# EAGLE schematic MultiDrop (EAGLE 7.6.0)
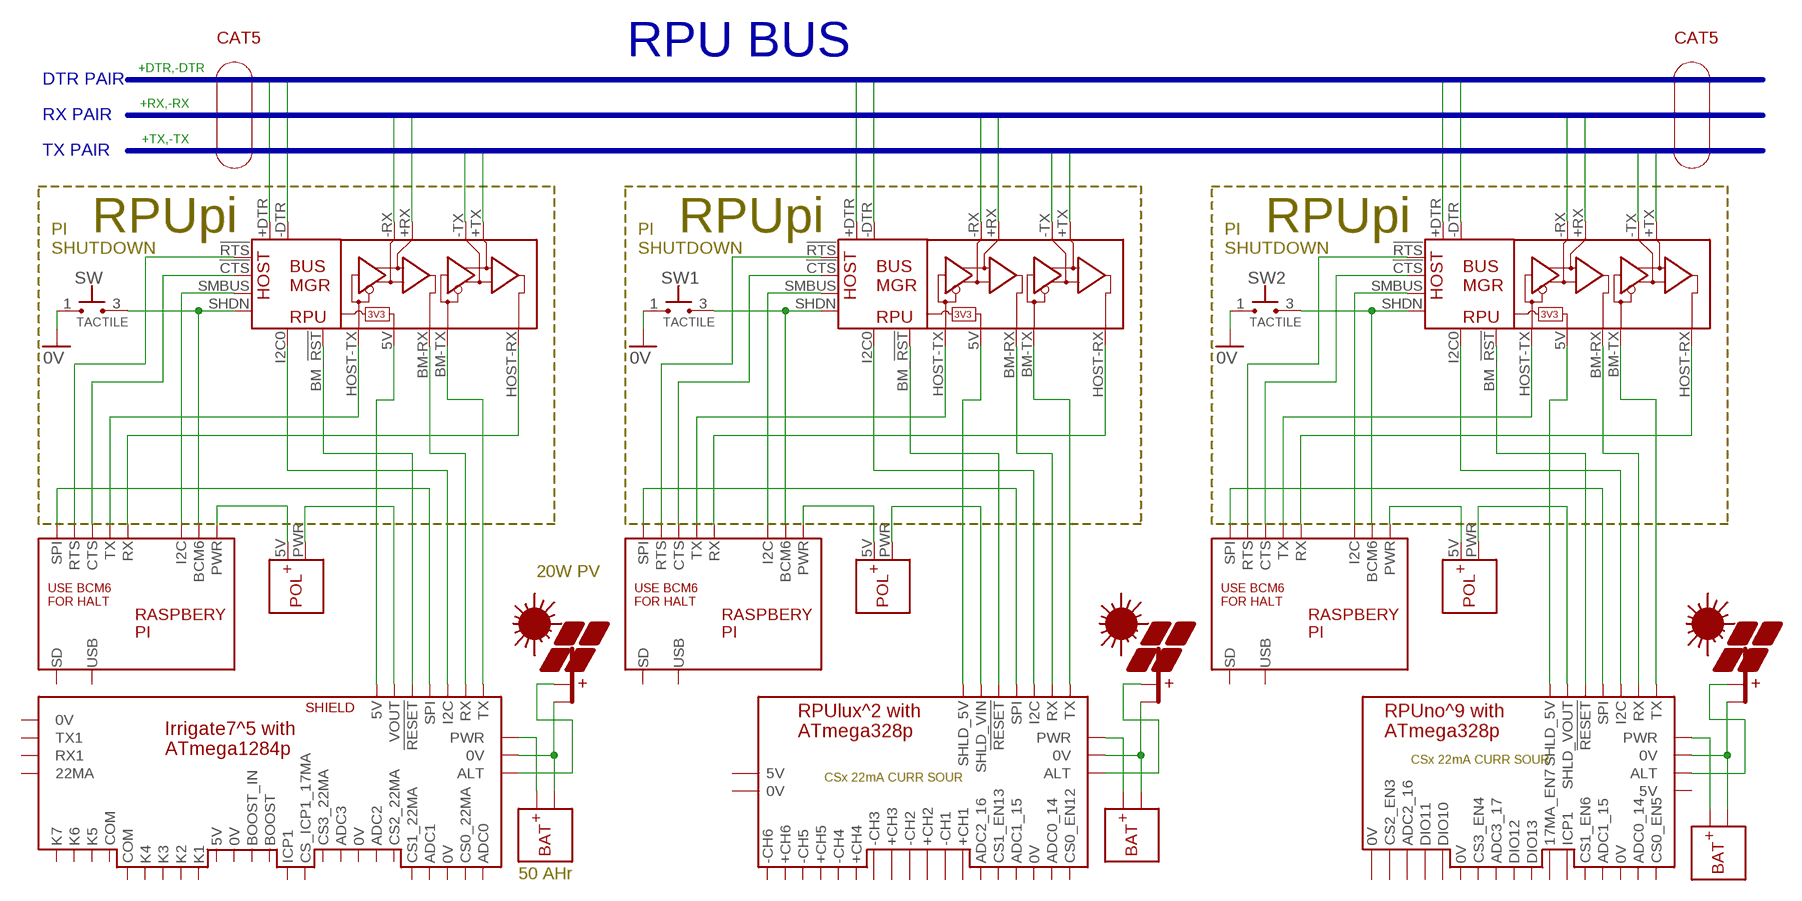
[diagram p0: schematic, sheet 1]

## Parts
BM1  RPUNO  [NA-30]
PV1  PV  [NA-30]
PV2  PV  [NA-30]
PV4  PV  [NA-30]
SW  TACTILE  TAC_SW  [KS11]
SW1  TACTILE  TAC_SW  [KS11]
SW2  TACTILE  TAC_SW  [KS11]
U$1  IRRIGATE7  [WITH_RPU_NAMES]
U$2  RPULUX  [WITH_RPU_NAMES]
U$3  BUS_MGR  [WITH_RPU_NAMES]
U$4  BAT  [NA-30]
U$5  PI  [NA-30]
U$6  BUS_MGR  [WITH_RPU_NAMES]
U$7  BAT  [NA-30]
U$8  BUS_MGR  [WITH_RPU_NAMES]
U$9  BAT  [NA-30]
U$10  PI  [NA-30]
U$11  PI  [NA-30]
U$12  POL  [WITH_RPU_NAMES]
U$13  POL  [WITH_RPU_NAMES]
U$14  POL  [WITH_RPU_NAMES]

## Nets
0V: SW1.1 SW2.1 SW.1
+DTR: U$8.+DTR
+DTR1: U$3.+DTR
+DTR2: U$6.+DTR
+RX: U$8.+RX
+RX1: U$3.+RX
+RX2: U$6.+RX
+TX: U$8.+TX
+TX1: U$3.+TX
+TX2: U$6.+TX
-DTR: U$8.-DTR
-DTR1: U$3.-DTR
-DTR2: U$6.-DTR
-RX: U$8.-RX
-RX1: U$3.-RX
-RX2: U$6.-RX
-TX: U$8.-TX
-TX1: U$3.-TX
-TX2: U$6.-TX
N$1: U$1.TX U$8.BM-TX(BM_TX)
N$2: U$1.RX U$8.BM-RX(BM_RX)
N$3: U$1.SHLD_VOUT(VOUT) U$12.PWR(VIN)
N$4: U$8.SMBUS U$11.8(I2C)
N$5: SW.3 U$8.SHDN U$11.7(BCM6)
N$6: U$1.SPI U$11.10(SPI)
N$7: PV1.2(-PV) U$1.0V@PWR(0V) U$4.2(-BAT)
N$8: U$8.HOST-RX(HOST_RX) U$11.3(RX)
N$9: U$8.HOST-TX(HOST_TX) U$11.4(TX)
N$10: U$2.TX U$3.BM-TX(BM_TX)
N$11: U$2.RX U$3.BM-RX(BM_RX)
N$12: U$1.PWR U$4.1(+BAT)
N$13: U$8.!CTS U$11.1(CTS)
N$14: U$3.HOST-RX(HOST_RX) U$5.3(RX)
N$15: PV1.1(+PV) U$1.AUX(ALT)
N$16: U$8.!RTS U$11.2(RTS)
N$17: U$3.HOST-TX(HOST_TX) U$5.4(TX)
N$18: U$2.SHLD_5V U$3.5V(PWR)
N$19: U$2.!RESET U$3.BM_!RST!(BM-!RST!)
N$20: U$2.I2C U$3.I2C0
N$21: U$2.SHLD_VOUT(SHLD_VIN) U$13.PWR(VIN)
N$22: U$2.SPI U$5.10(SPI)
N$23: U$3.SMBUS U$5.8(I2C)
N$24: SW1.3 U$3.SHDN U$5.7(BCM6)
N$25: U$3.!CTS U$5.1(CTS)
N$26: U$3.!RTS U$5.2(RTS)
N$27: BM1.1(TX) U$6.BM-TX(BM_TX)
N$28: BM1.2(RX) U$6.BM-RX(BM_RX)
N$29: U$1.SHLD_5V(5V) U$8.5V(PWR)
N$30: U$1.!RESET U$8.BM_!RST!(BM-!RST!)
N$31: U$6.HOST-RX(HOST_RX) U$10.3(RX)
N$32: U$6.HOST-TX(HOST_TX) U$10.4(TX)
N$33: U$1.I2C U$8.I2C0
N$34: BM1.6(SHLD_5V) U$6.5V(PWR)
N$35: BM1.5(!RESET) U$6.BM_!RST!(BM-!RST!)
N$36: BM1.3(I2C) U$6.I2C0
N$37: BM1.7(SHLD_VOUT) U$14.PWR(VIN)
N$38: BM1.4(SPI) U$10.10(SPI)
N$39: U$6.SMBUS U$10.8(I2C)
N$40: SW2.3 U$6.SHDN U$10.7(BCM6)
N$41: U$6.!CTS U$10.1(CTS)
N$42: U$6.!RTS U$10.2(RTS)
N$43: PV2.2(-PV) U$2.0V@PWR(0V) U$9.2(-BAT)
N$44: U$2.PWR U$9.1(+BAT)
N$45: PV2.1(+PV) U$2.AUX(ALT)
N$46: BM1.9(0V) PV4.2(-PV) U$7.2(-BAT)
N$47: BM1.8(PWR) U$7.1(+BAT)
N$48: BM1.20(ALT) PV4.1(+PV)
N$49: U$10.12(PWR) U$14.5V
N$50: U$5.12(PWR) U$13.5V
N$51: U$11.12(PWR) U$12.5V
Unconnected: BM1.10(ADC1_15) BM1.11(ADC0_14) BM1.12(ICP1) BM1.13(ADC2_16) BM1.14(DIO11) BM1.15(DIO10) BM1.16(ADC3_17) BM1.17(DIO12) BM1.18(DIO13) BM1.19(5V) BM1.21(17MA_EN7) BM1.22(CS1_EN6) BM1.23(CS0_EN5) BM1.24(CS2_EN3) BM1.26(0V) BM1.27(0V) BM1.28(0V) BM1.29(CS3_EN4) U$1.0V U$1.0V@ADC2(0V) U$1.5V U$1.17MA@ICP1(CS_ICP1_17MA) U$1.17MA@ICP3(0V) U$1.22MA@ADC0(CS0_22MA) U$1.22MA@ADC1(CS1_22MA) U$1.22MA@ADC4(CS2_22MA) U$1.22MA@ADC5(CS3_22MA) U$1.22MA@DIO2(22MA) U$1.ADC0 U$1.ADC1 U$1.ADC4(ADC2) U$1.ADC5(ADC3) U$1.BOOST U$1.BOOST_IN U$1.COM@K4(COM) U$1.COM@K5(COM) U$1.DIO2(RX1) U$1.DIO3(TX1) U$1.ICP1 U$1.ICP3(0V) U$1.K1 U$1.K2 U$1.K3 U$1.K4 U$1.K5 U$1.K6 U$1.K7 U$2.0V U$2.0V@DIO2(0V) U$2.5V U$2.22MA@ADC0(CS0_EN12) U$2.22MA@ADC1(CS1_EN13) U$2.+CH1 U$2.+CH2 U$2.+CH3 U$2.+CH4 U$2.+CH5 U$2.+CH6 U$2.-CH1 U$2.-CH2 U$2.-CH3 U$2.-CH4 U$2.-CH5 U$2.-CH6 U$2.ADC0(ADC0_14) U$2.ADC1(ADC1_15) U$2.ADC2(ADC2_16) U$5.9(SD) U$5.11(USB) U$10.9(SD) U$10.11(USB) U$11.9(SD) U$11.11(USB)

## Buses
+DTR,-DTR
+RX,-RX
+TX,-TX

## Notes on the sheet
- CAT5 | CAT5
- RPU BUS
- DTR PAIR
- RX PAIR
- TX PAIR
- RPUpi | RPUpi | RPUpi
- PI
  SHUTDOWN
- PI
  SHUTDOWN
- PI
  SHUTDOWN
- 20W PV
- 50 AHr

## Library data of the parts
BM1 = Documentation:RPUNO: BM /w 328p
PV1 PV2 PV4 = Documentation:PV
SW SW1 SW2 = S-Tactile:TAC_SW: KS11 [C&K,KS11R21CQE] SWITCH PUSHBUTTON SPST-NO 25MA 50V PAD 0805
U$1 = Documentation:IRRIGATE7: BM /w 1284p
U$2 = Documentation:RPULUX
U$3 U$6 U$8 = Documentation:BUS_MGR: RPU BUS MANAGER
U$4 U$7 U$9 = Documentation:BAT
U$5 U$10 U$11 = Documentation:PI: Raspbery Pi
U$12-U$14 = Documentation:POL